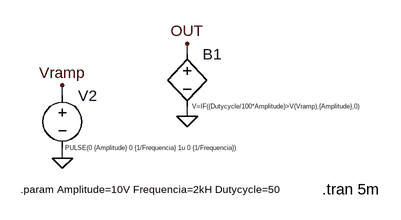
[diagram p0: schematic BV PWM.asc]
BV PWM.asc, the LTspice schematic file:
Version 4
SHEET 1 880 680
WIRE 176 96 176 80
WIRE -16 160 -16 144
WIRE 176 192 176 176
WIRE -16 256 -16 240
FLAG -16 256 0
FLAG 176 192 0
FLAG -16 144 Vramp
FLAG 176 80 OUT
SYMBOL voltage -16 144 R0
WINDOW 3 4 96 Left 0
WINDOW 123 0 0 Left 0
WINDOW 39 0 0 Left 0
SYMATTR Value PULSE(0 {Amplitude} 0 {1/Frequencia} 1u 0 {1/Frequencia})
SYMATTR InstName V2
SYMBOL bv 176 80 R0
WINDOW 3 8 96 Left 0
SYMATTR Value V=IF((Dutycycle/100*Amplitude)>V(Vramp),{Amplitude},0)
SYMATTR InstName B1
TEXT -80 304 Left 1 !.param Amplitude=10V Frequencia=2kH Dutycycle=50
TEXT 384 304 Left 2 !.tran 5m

The netlist it stands for:
* BV PWM.asc
V2 Vramp 0 PULSE(0 {Amplitude} 0 {1/Frequencia} 1u 0 {1/Frequencia})
B1 OUT 0 V=IF((Dutycycle/100*Amplitude)>V(Vramp),{Amplitude},0)
.param Amplitude=10V Frequencia=2kH Dutycycle=50
.tran 5m
.backanno
.end